# Altium schematic sheet MacropadSchmatic.SchDoc
size A; SheetNumber: 1; SheetTotal: 1
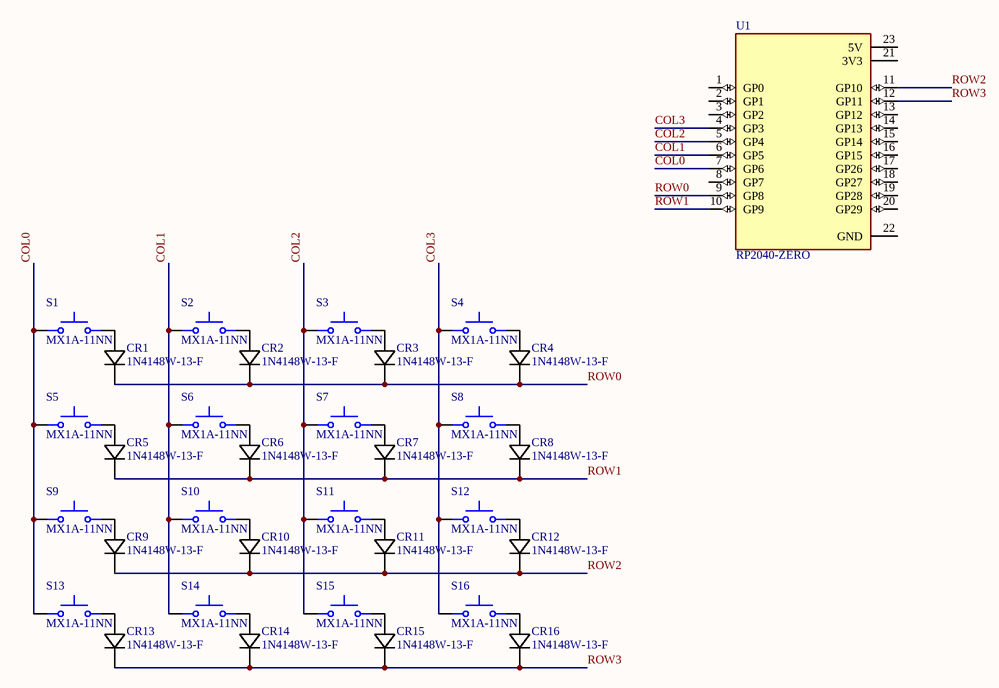
[diagram p0: MacropadSchmatic.SchDoc]

## Parts
CR1  1N4148W-13-F  [SOD123_DIO]
CR2  1N4148W-13-F  [SOD123_DIO]
CR3  1N4148W-13-F  [SOD123_DIO]
CR4  1N4148W-13-F  [SOD123_DIO]
CR5  1N4148W-13-F  [SOD123_DIO]
CR6  1N4148W-13-F  [SOD123_DIO]
CR7  1N4148W-13-F  [SOD123_DIO]
CR8  1N4148W-13-F  [SOD123_DIO]
CR9  1N4148W-13-F  [SOD123_DIO]
CR10  1N4148W-13-F  [SOD123_DIO]
CR11  1N4148W-13-F  [SOD123_DIO]
CR12  1N4148W-13-F  [SOD123_DIO]
CR13  1N4148W-13-F  [SOD123_DIO]
CR14  1N4148W-13-F  [SOD123_DIO]
CR15  1N4148W-13-F  [SOD123_DIO]
CR16  1N4148W-13-F  [SOD123_DIO]
S1  MX1A-11NN  [SW_MX1A-11NN]
S2  MX1A-11NN  [SW_MX1A-11NN]
S3  MX1A-11NN  [SW_MX1A-11NN]
S4  MX1A-11NN  [SW_MX1A-11NN]
S5  MX1A-11NN  [SW_MX1A-11NN]
S6  MX1A-11NN  [SW_MX1A-11NN]
S7  MX1A-11NN  [SW_MX1A-11NN]
S8  MX1A-11NN  [SW_MX1A-11NN]
S9  MX1A-11NN  [SW_MX1A-11NN]
S10  MX1A-11NN  [SW_MX1A-11NN]
S11  MX1A-11NN  [SW_MX1A-11NN]
S12  MX1A-11NN  [SW_MX1A-11NN]
S13  MX1A-11NN  [SW_MX1A-11NN]
S14  MX1A-11NN  [SW_MX1A-11NN]
S15  MX1A-11NN  [SW_MX1A-11NN]
S16  MX1A-11NN  [SW_MX1A-11NN]
U1  RP2040-ZERO  [MODULE_RP2040-ZERO]

## Nets
COL0: S1.1 S5.1 S9.1 S13.1 U1.7(GP6)
COL1: S2.1 S6.1 S10.1 S14.1 U1.6(GP5)
COL2: S3.1 S7.1 S11.1 S15.1 U1.5(GP4)
COL3: S4.1 S8.1 S12.1 S16.1 U1.4(GP3)
ROW0: CR1.1 CR2.1 CR3.1 CR4.1 U1.9(GP8)
ROW1: CR5.1 CR6.1 CR7.1 CR8.1 U1.10(GP9)
ROW2: CR9.1 CR10.1 CR11.1 CR12.1 U1.11(GP10)
ROW3: CR13.1 CR14.1 CR15.1 CR16.1 U1.12(GP11)
NetCR1_2: CR1.2 S1.2
NetCR2_2: CR2.2 S2.2
NetCR3_2: CR3.2 S3.2
NetCR4_2: CR4.2 S4.2
NetCR5_2: CR5.2 S5.2
NetCR6_2: CR6.2 S6.2
NetCR7_2: CR7.2 S7.2
NetCR8_2: CR8.2 S8.2
NetCR9_2: CR9.2 S9.2
NetCR10_2: CR10.2 S10.2
NetCR11_2: CR11.2 S11.2
NetCR12_2: CR12.2 S12.2
NetCR13_2: CR13.2 S13.2
NetCR14_2: CR14.2 S14.2
NetCR15_2: CR15.2 S15.2
NetCR16_2: CR16.2 S16.2

Not connected (* = marked no-connect by the designer): U1 1(GP0) 2(GP1) 3(GP2) 8(GP7) 13(GP12) 14(GP13) 15(GP14) 16(GP15) 17(GP26) 18(GP27) 19(GP28) 20(GP29) 21(3V3) 22(GND) 23(5V)

## Library data of the parts
CR1-CR16 = CMP-446-000000-1: Description; Manufacturer_Name: Diodes Inc; Manufacturer_Part_Number: 1N4148W-13-F; Copyright: Copyright (C) 2025 Ultra Librarian. All rights reserved.; Source: 1N4148W-13-F.SchLib; Design Item ID: 1N4148W-13-F
S1-S16 = CMP-011-00017-1: Switch,Key,SPST-NO,Keyboard,Low Profile,10mA,12VDC,Face Place Mount,Std Force; MF: Cherry; SnapEDA_Link: https://www.snapeda.com/parts/MX1A-11NN/Cherry/view-part/?ref=snap; Case/Package: None; Component Type: Standard; Pins: 2; Design Item ID: MX1A-11NN; Check_prices: https://www.snapeda.com/parts/MX1A-11NN/Cherry/view-part/?ref=eda; Value: *; MP: MX1A-11NN; Source: MX1A-11NN.SchLib
U1 = CMP-438-000000-1: Low-Cost, High-Performance Pico-Like MCU Board Based On Raspberry Pi Microcontroller RP2040; MF: Waveshare Electronics; Package: Package; Pin Count: 23; SnapEDA_Link: https://www.snapeda.com/parts/RP2040-ZERO/Waveshare+Electronics/view-part/?ref=snap; Value: *; Component Type: Standard; MP: RP2040-ZERO; Design Item ID: RP2040-ZERO; Source: RP2040-ZERO.SchLib; Check_prices: https://www.snapeda.com/parts/RP2040-ZERO/Waveshare+Electronics/view-part/?ref=eda